# Altium schematic sheet v1.1.SchDoc
size 76 x 50 mm
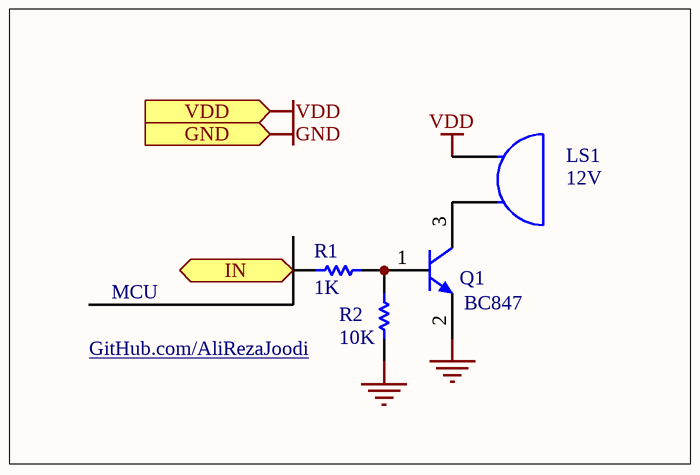
[diagram p0: v1.1.SchDoc]

## Parts
LS1  value 12V  [RB_7.62mm]  (hidden comment: Buzzer)
Q1  value BC847  [SOT23-3N]  (hidden comment: NPN)
R1  value 1K  [0805]  (hidden comment: Res1)
R2  value 10K  [0805]  (hidden comment: Res1)

## Ports
GND (in), IN (in), VDD (in)

## Nets
GND: Q1.2(E) R2.2 ; port GND
VDD: LS1.1(A) ; port VDD
IN: R1.2 ; port IN
NetLS1_2: LS1.2(B) Q1.3(C)
NetQ1_1: Q1.1(B) R1.1 R2.1

## Notes on the sheet
- GitHub.com/AliRezaJoodi
- MCU

## Library data of the parts
LS1 = Buzzer: Sounder; Manufacturer: Generic Components; Published: 24-Mar-1999; Revision: July-2002: Re-released for DXP Platform.; Publisher: Altium Limited
Q1 = BC847: Silicon Bipolar Transistor
R1 R2 = Res1: Resistor; Published: 8-Jun-2000; LatestRevisionDate: 17-Jul-2002; LatestRevisionNote: Re-released for DXP Platform.; PackageReference: AXIAL-0.3; Publisher: Altium Limited